# EAGLE design Adafruit ANO Rotary Encoder Breakout (EAGLE 9.6.2)
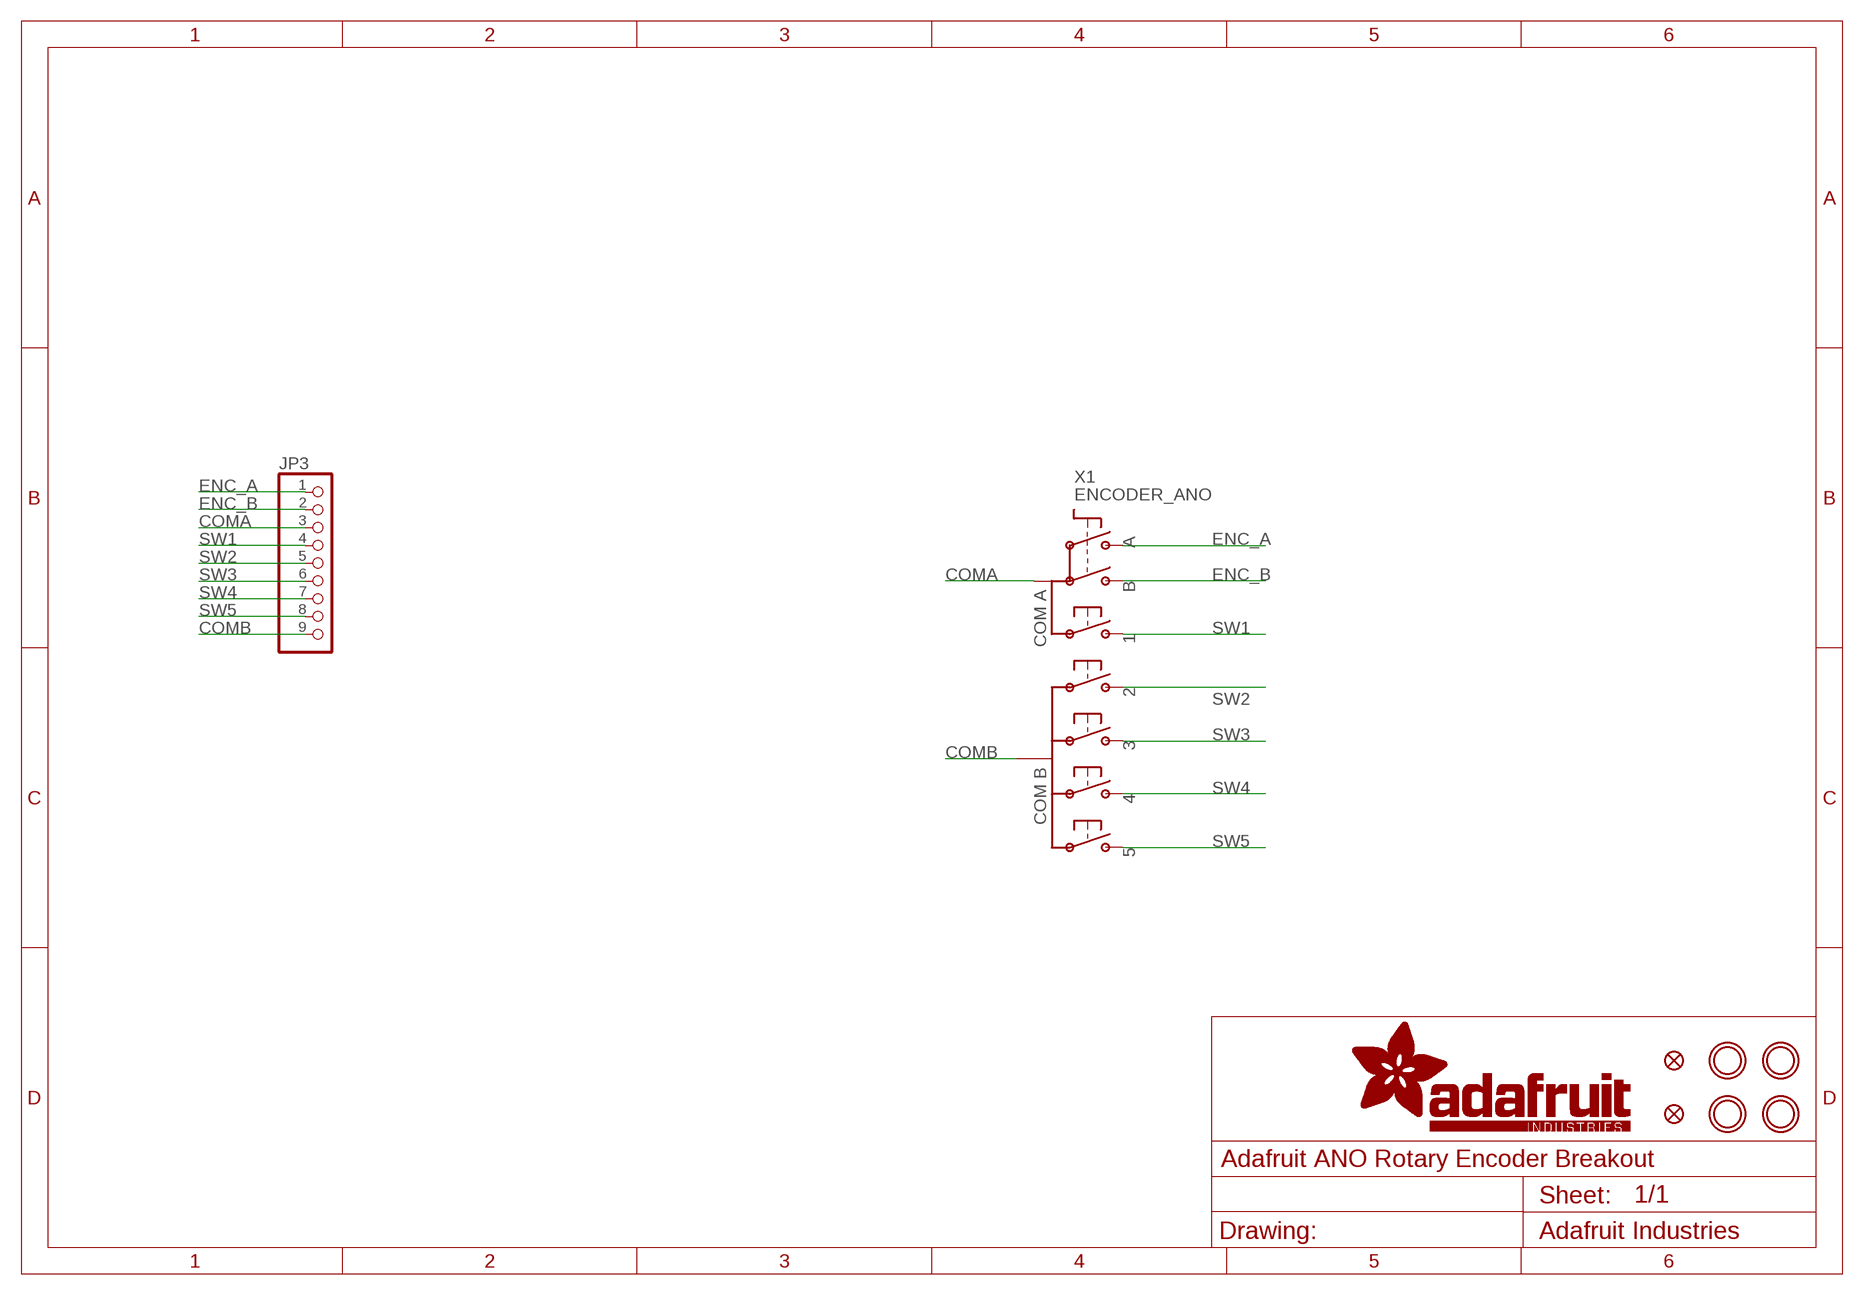
[diagram p0: schematic, sheet 1]

## Parts
FID3  FIDUCIAL_1MM  [FIDUCIAL_1MM]
FID4  FIDUCIAL_1MM  [FIDUCIAL_1MM]
JP3  HEADER-1X970MIL  [1X09_ROUND_70]
U$25  MOUNTINGHOLE2.5  [MOUNTINGHOLE_2.5_PLATED]
U$27  MOUNTINGHOLE2.5  [MOUNTINGHOLE_2.5_PLATED]
U$29  MOUNTINGHOLE2.5  [MOUNTINGHOLE_2.5_PLATED]
U$30  MOUNTINGHOLE2.5  [MOUNTINGHOLE_2.5_PLATED]
X1  ENCODER_ANO  [ENCODER_ANO]

## Nets
COMA: JP3.3 X1.COM_A(COMA)
COMB: JP3.9 X1.COM_B
ENC_A: JP3.1 X1.A
ENC_B: JP3.2 X1.B
SW1: JP3.4 X1.S1
SW2: JP3.5 X1.S2
SW3: JP3.6 X1.S3
SW4: JP3.7 X1.S4
SW5: JP3.8 X1.S5

## Library data of the parts
FID3 FID4 = microbuilder:FIDUCIAL: Fiducial Alignment Points Various fiducial points for machine vision alignment.; BOM: EXCLUDE
JP3 = microbuilder:HEADER-1X9: PIN HEADER
U$25 U$27 U$29 U$30 = microbuilder:MOUNTINGHOLE: Mounting Hole For #2 screws (0.086"/2.18mm width, 0.094"/2.4mm hole) use 2.5mm; BOM: EXCLUDE
X1 = adafruit_electromech:ENCODER_ANO

## Net classes
1 highpower: width 0.406 mm, drill 0.483 mm
2 lowpower: width 0.305 mm, drill 0.483 mm

## Board
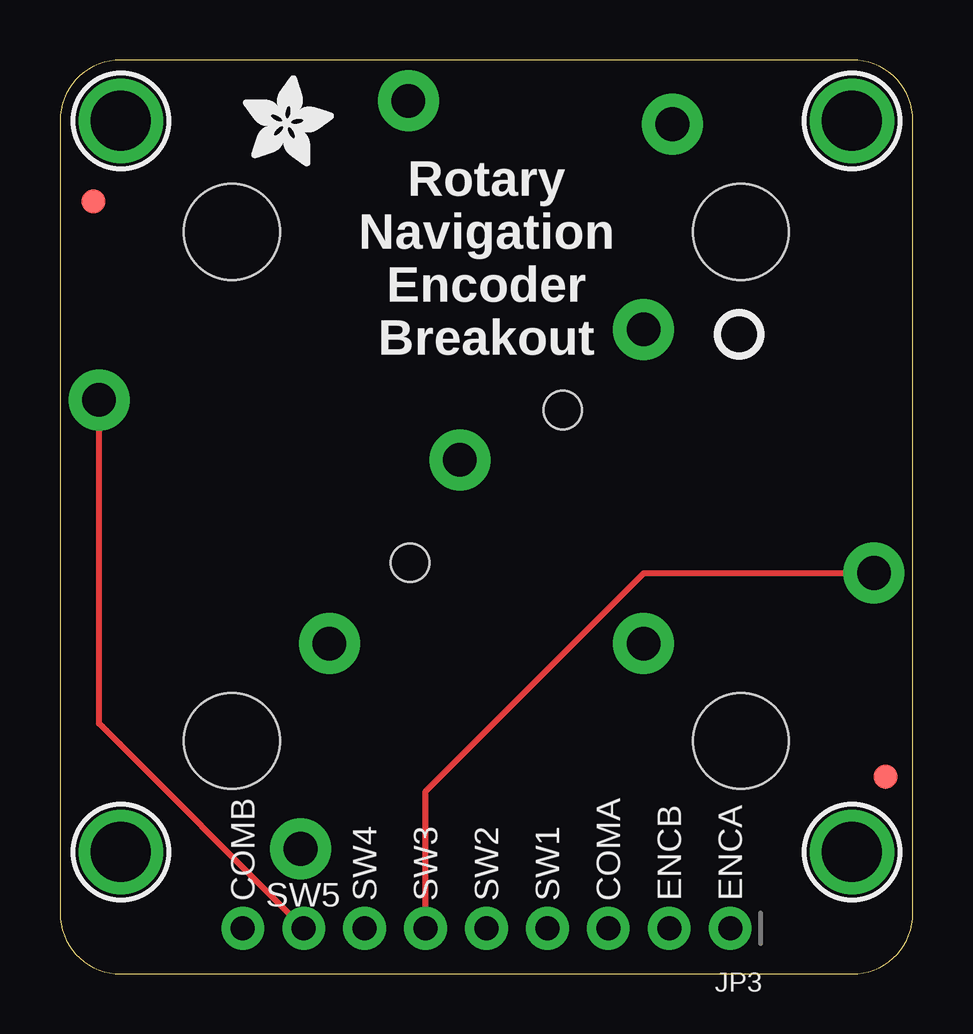
[diagram p1: board, top side]
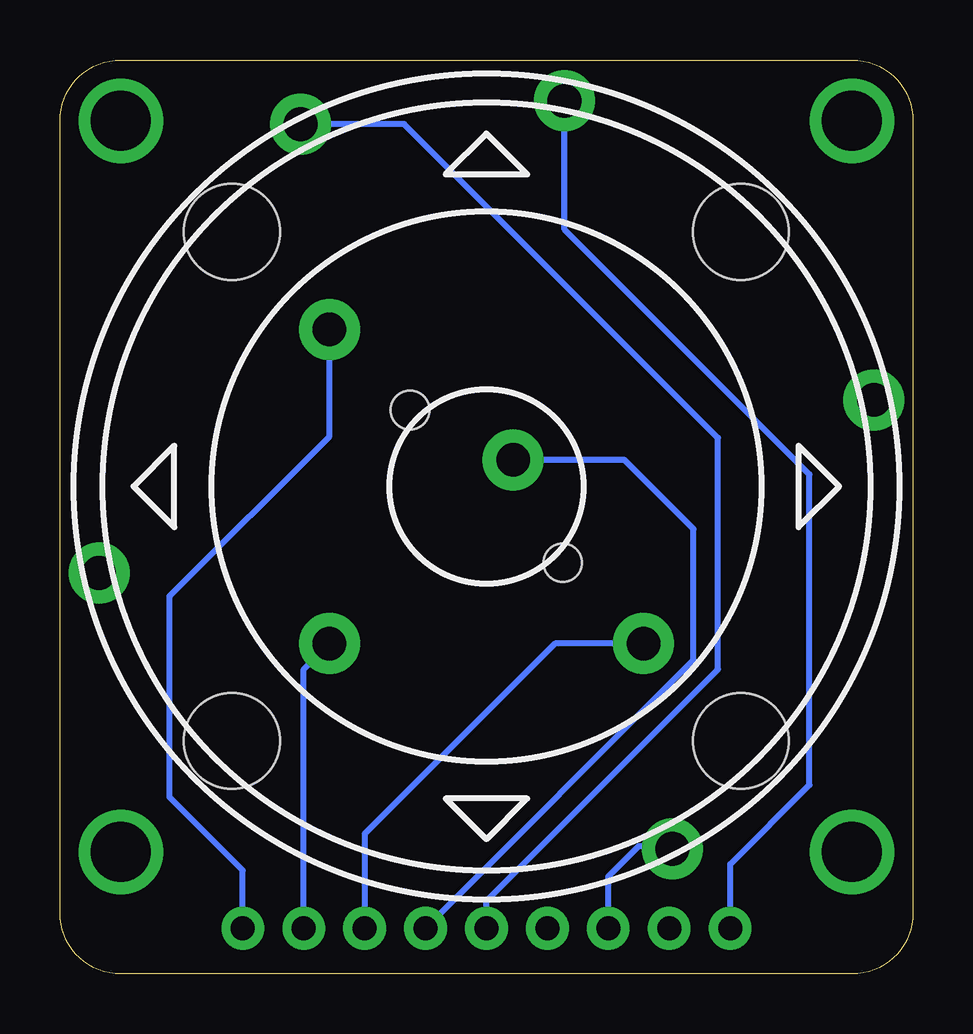
[diagram p2: board, bottom side, seen from below]

Size 35.56 x 38.1 mm. Coordinates in mm from the lower left corner, seen from the top.
Outline: 35.56,2.54 35.56,35.56 arc90 33.02,38.1 2.54,38.1 arc90 0,35.56 0,2.54 arc90 2.54,0 33.02,0 arc90 35.56,2.54
Copper layers (1*16): Top 0.035mm / dielectric 1.5mm / Bottom 0.035mm
Design rules "adafruit *": minimum track width 8mil, minimum drill 15.5mil, track to track 8mil, track to pad 8mil, pad to pad 8mil, via to via 8mil, smd to smd 8mil, copper to edge 10mil, drill to drill 8mil, minimum pad ring 10mil, minimum via ring 8mil, stop-mask expansion 2mil, vias tented up to drill 20mil, thermal gap 10mil

### Footprints (pad centres in the part's own frame; a part is rotated, then mirrored left to right if it is on the bottom)
FIDUCIAL_1MM = smd 1 x 1: 1 0,0
1X09_ROUND_70 = drill 1 pad 1.778: 1 -10.16,0; 2 -7.62,0; 3 -5.08,0; 4 -2.54,0; 5 0,0; 6 2.54,0; 7 5.08,0; 8 7.62,0; 9 10.16,0
MOUNTINGHOLE_2.5_PLATED = drill 2.5 pad 3.2: P$1 0,0
ENCODER_ANO = drill 1.4 pad 2.54: A 0,-9.26; B 9.26,0; COM_A 0,9.26; COM_B -13.67,-9.07; S1 -1.57,0; S2 -5.2,-16.16; S3 13.97,-8.87; S4 5.2,16.16; S5 -13.97,8.87 | hole 1.6: 0,4.5; 0,-4.5 | hole 4: 0,15; 0,-15; -15,0; 15,0

### Placement (x,y rotation side)
FID3  1.4,32.19 180 top
FID4  34.42,8.22 180 top
JP3  17.78,1.91 180 top
U$25  33.02,5.08 180 top
U$27  2.54,5.08 180 top
U$29  33.02,35.56 180 top
U$30  2.54,35.56 180 top
U$32  [ADAFRUIT_3.5MM]  7.62,33.66 0 top
U$33  [PCBFEAT-REV-040]  28.32,26.67 180 top
X1  17.78,20.32 225 bottom

### Tracks (layer width: path | path; a pad name or v marks a point on that pad's centre or on a via)
COMA
  Bottom 0.254: X1.COM_A 14.93,13.77 22.86,5.84 JP3.3
COMB
  Bottom 0.254: JP3.9 7.62,4.57 4.32,7.87 4.32,20.83 14.53,31.04 X1.COM_B
ENC_A
  Bottom 0.254: JP3.1 27.94,4.32 30.99,7.37 30.99,15.75 24.33,22.41 X1.A
ENC_B
  Bottom 0.254: JP3.2 25.4,12.7 X1.B
SW1
  Bottom 0.254: JP3.4 9.14,13.08 9.14,18.54 12.03,21.43 X1.S1
SW2
  Bottom 0.254: JP3.5 17.78,3.05 8.13,12.7 8.13,22.34 21.21,35.42 X1.S2
SW3
  Top 0.254: JP3.6 15.24,7.62 24.33,16.71 X1.S3
SW4
  Bottom 0.254: JP3.7 12.7,4.06 11.43,5.33 10.15,5.33 X1.S4
SW5
  Top 0.254: JP3.8 1.63,10.44 X1.S5

### Text on the board
tPlace: Rotary / Navigation / Encoder / Breakout | COMB | SW5 | SW4 | SW3 | SW2 | SW1 | COMA | ENCB | ENCA